# Altium project Flight_controller.PrjPcb
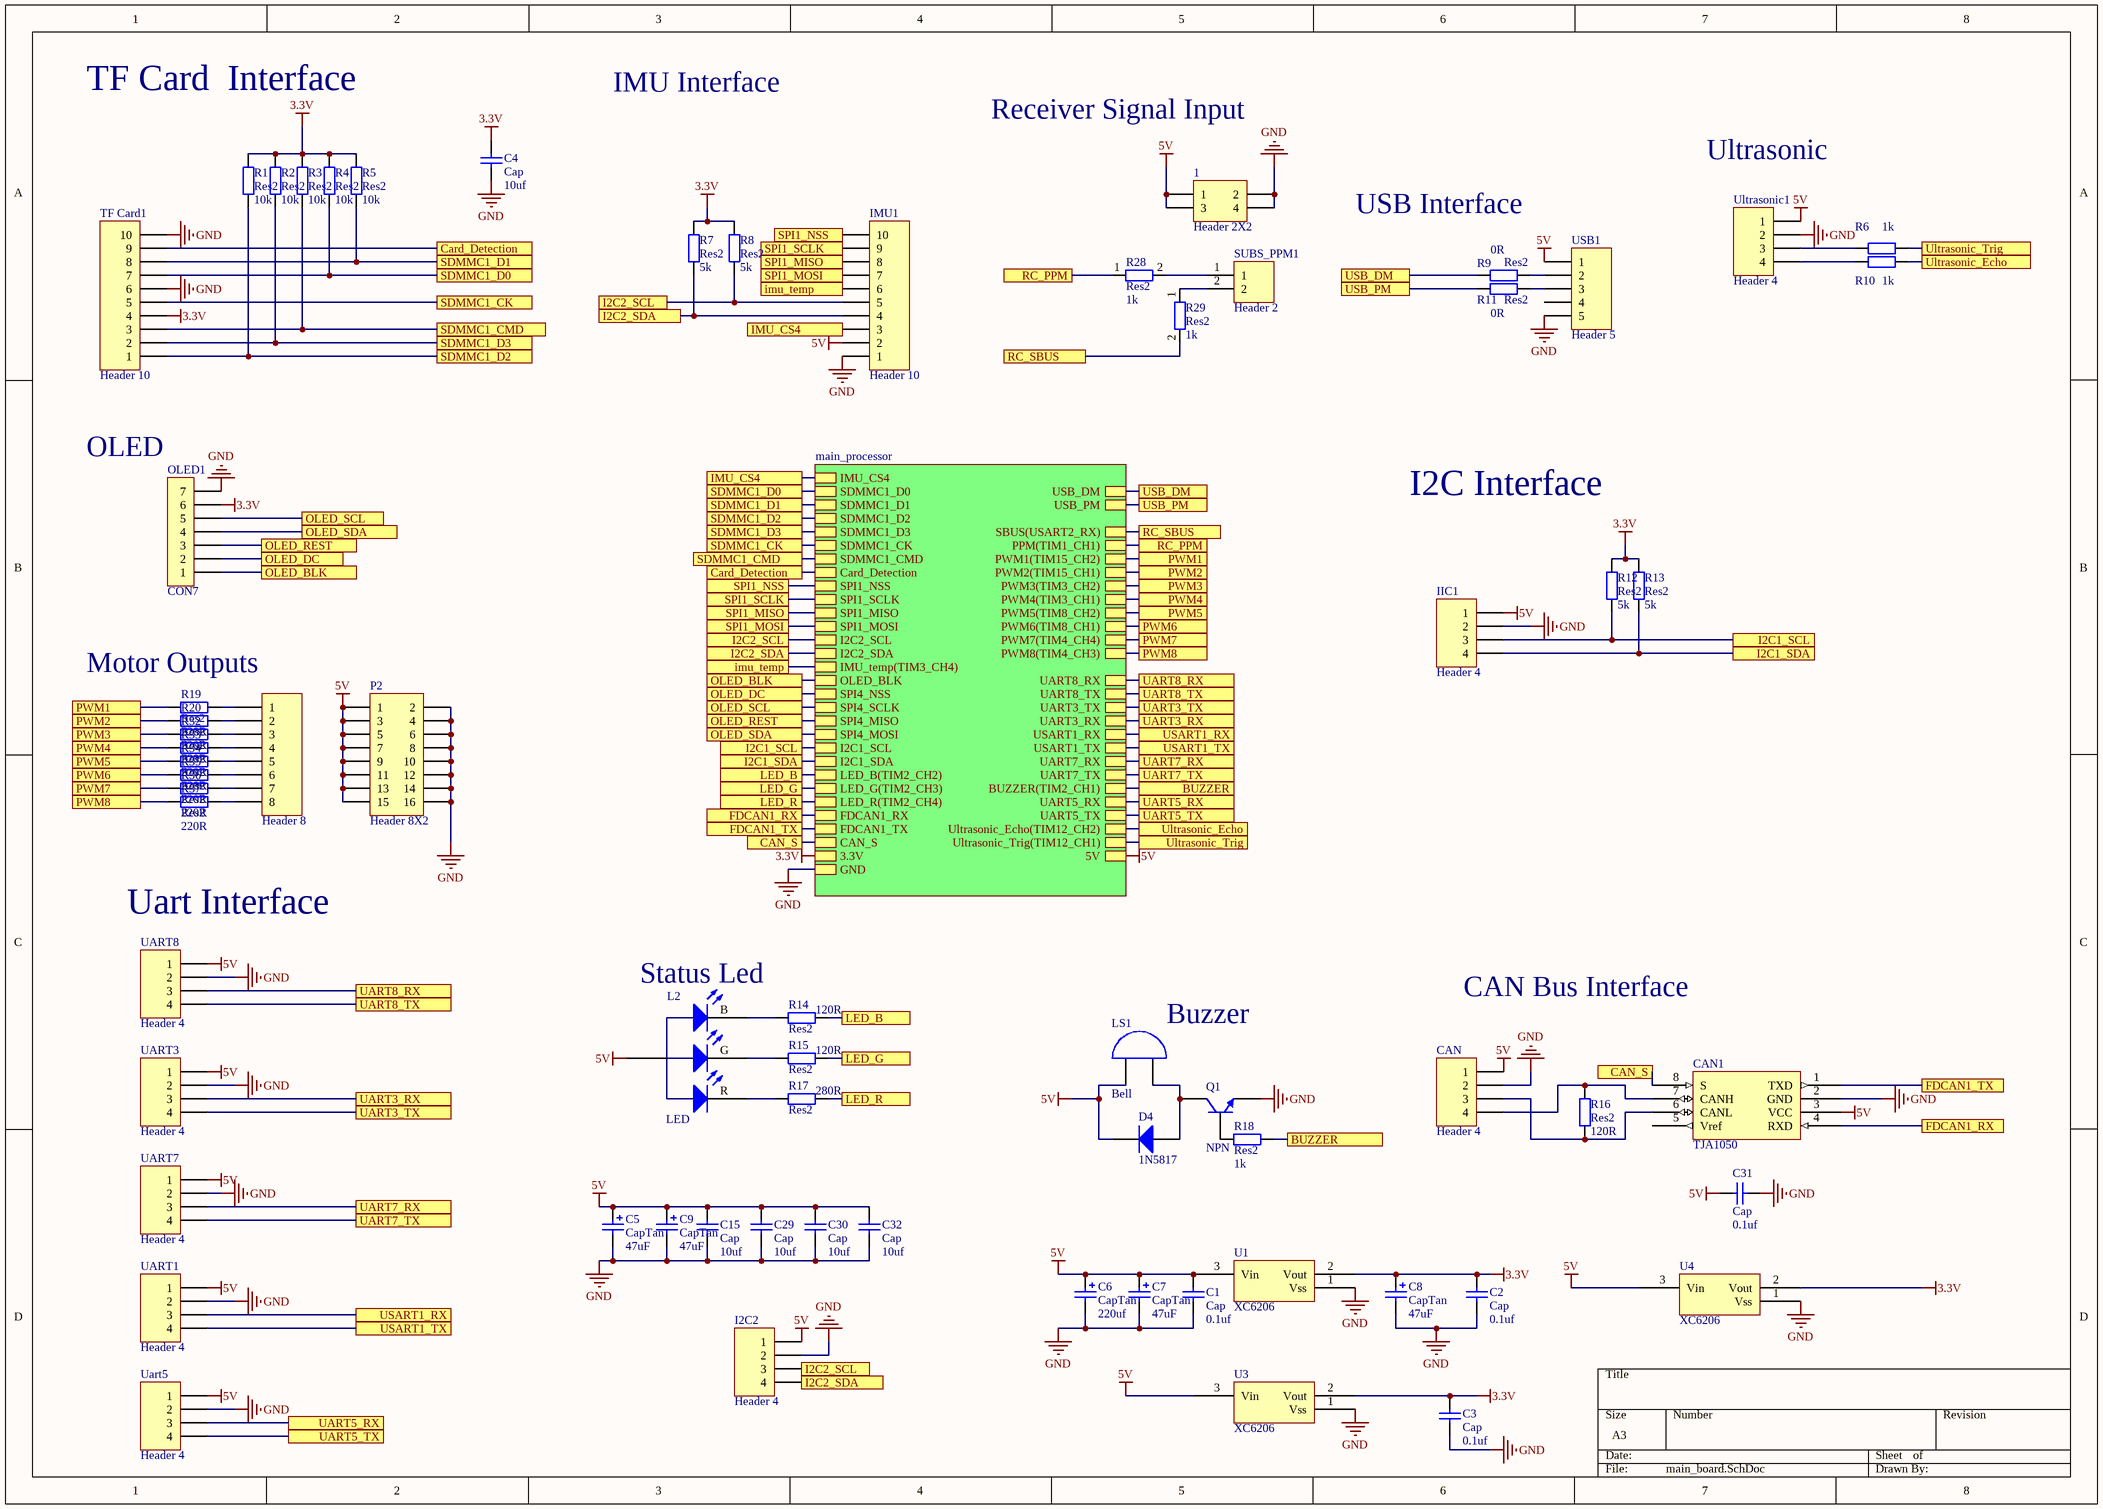
[diagram p0: main_board.SchDoc]
2 sheets, 107 parts. Net scope: strictly hierarchical (ports join the sheet entries above them; power ports are local).
Sheets:
  main_board.SchDoc
    main_processor = main_processor.SchDoc

## Sheet main_board.SchDoc
size A3

### Parts
1  Header 2X2  [HDR2X2]
?  Header 8  [HDR1X8]
C1  Cap  value 0.1uf  [0603]
C2  Cap  value 0.1uf  [0603]
C3  Cap  value 0.1uf  [0603]
C4  Cap  value 10uf  [0603]
C5  CapTan  value 47uF  [1206_P]
C6  CapTan  value 220uf  [3528_P]
C7  CapTan  value 47uF  [1206_P]
C8  CapTan  value 47uF  [1206_P]
C9  CapTan  value 47uF  [1206_P]
C15  Cap  value 10uf  [0603]
C29  Cap  value 10uf  [0603]
C30  Cap  value 10uf  [0603]
C31  Cap  value 0.1uf  [0603]
C32  Cap  value 10uf  [0603]
CAN  Header 4  [SH_1.25mm_LT_4P]
CAN1  TJA1050  [SO8_M]
D4  1N5817  [SOD323]
I2C2  Header 4  [SH_1.25mm_LT_4P]
IIC1  Header 4  [SH_1.25mm_LT_4P]
IMU1  Header 10  [FPC 0.5mm 10pin]
L2  LED  [LED_3528_RGB]
LS1  Bell  [Buzzer_1030]
OLED1  CON7  [HDR1X7]
P2  Header 8X2  [HDR2X8]
Q1  NPN  [SOT23_N]
R1  Res2  value 10k  [0603]
R2  Res2  value 10k  [0603]
R3  Res2  value 10k  [0603]
R4  Res2  value 10k  [0603]
R5  Res2  value 10k  [0603]
R6  value 1k  [0603]  (hidden comment: Res2)
R7  Res2  value 5k  [0603]
R8  Res2  value 5k  [0603]
R9  Res2  value 0R  [0603]
R10  value 1k  [0603]  (hidden comment: Res2)
R11  Res2  value 0R  [0603]
R12  Res2  value 5k  [0603]
R13  Res2  value 5k  [0603]
R14  Res2  value 120R  [0603]
R15  Res2  value 120R  [0603]
R16  Res2  value 120R  [0603]
R17  Res2  value 280R  [0603]
R18  Res2  value 1k  [0603]
R19  Res2  value 220R  [0603]
R20  Res2  value 220R  [0603]
R28  Res2  value 1k  [0603]
R29  Res2  value 1k  [0603]
R32  Res2  value 220R  [0603]
R33  Res2  value 220R  [0603]
R34  Res2  value 220R  [0603]
R35  Res2  value 220R  [0603]
R36  Res2  value 220R  [0603]
R37  Res2  value 220R  [0603]
SUBS_PPM1  Header 2  [HDR1X2]
TF_Card1  Header 10  [MicroSD]
U1  XC6206  [SOT23]
U3  XC6206  [SOT23]
U4  XC6206  [SOT23]
UART1  Header 4  [SH_1.25mm_LT_4P]
UART3  Header 4  [SH_1.25mm_LT_4P]
Uart5  Header 4  [SH_1.25mm_LT_4P]
UART7  Header 4  [SH_1.25mm_LT_4P]
UART8  Header 4  [SH_1.25mm_LT_4P]
Ultrasonic1  Header 4  [SH_1.25mm_LT_4P]
USB1  Header 5  [micro usb Type B SMC]

### Sub-sheets
main_processor = main_processor: SDMMC1_D0, SDMMC1_D1, SDMMC1_D2, SDMMC1_D3, SDMMC1_CK, SDMMC1_CMD, Card_Detection, SPI1_SCLK, SPI1_MISO, SPI1_MOSI, I2C2_SCL, I2C2_SDA, IMU_temp(TIM3_CH4), SPI1_NSS, SPI4_NSS, SPI4_SCLK, SPI4_MISO, SPI4_MOSI, USB_DM, USB_PM, PWM1(TIM15_CH2), PWM2(TIM15_CH1), PWM3(TIM3_CH2), PWM4(TIM3_CH1), PWM5(TIM8_CH2), PWM6(TIM8_CH1), PWM7(TIM4_CH4), PWM8(TIM4_CH3), UART8_RX, UART8_TX, UART3_TX, UART3_RX, USART1_RX, USART1_TX, UART7_RX, UART7_TX, I2C1_SCL, I2C1_SDA, LED_B(TIM2_CH2), LED_G(TIM2_CH3), LED_R(TIM2_CH4), BUZZER(TIM2_CH1), UART5_RX, UART5_TX, FDCAN1_RX, FDCAN1_TX, Ultrasonic_Echo(TIM12_CH2), Ultrasonic_Trig(TIM12_CH1), 3.3V, GND, 5V, SBUS(USART2_RX), PPM(TIM1_CH1), CAN_S, OLED_BLK, IMU_CS4

### Ports
BUZZER, CAN_S, Card_Detection, FDCAN1_RX, FDCAN1_TX, I2C1_SCL, I2C1_SDA, I2C2_SCL, I2C2_SDA, IMU_CS4, imu_temp, LED_B, LED_G, LED_R, OLED_BLK, OLED_DC, OLED_REST, OLED_SCL, OLED_SDA, PWM1, PWM2, PWM3, PWM4, PWM5, PWM6, PWM7, PWM8, RC_PPM, RC_SBUS, SDMMC1_CK, SDMMC1_CMD, SDMMC1_D0, SDMMC1_D1, SDMMC1_D2, SDMMC1_D3, SPI1_MISO, SPI1_MOSI, SPI1_NSS, SPI1_SCLK, UART3_RX, UART3_TX, UART5_RX, UART5_TX, UART7_RX, UART7_TX, UART8_RX, UART8_TX, Ultrasonic_Echo, Ultrasonic_Trig, USART1_RX, USART1_TX, USB_DM, USB_PM

### Nets
3.3V: C2.2 C3.2 C4.2 C8.1 OLED1.6 R1.2 R2.2 R3.1 R4.2 R5.2 R7.2 R8.2 R12.2 R13.2 TF_Card1.4 U1.2(Vout) U3.2(Vout) U4.2(Vout) ; sheet main_processor/3.3V
5V: 1.1 1.3 C1.2 C5.1 C6.1 C7.1 C9.1 C15.2 C29.2 C30.2 C31.2 C32.2 CAN.1 CAN1.3(VCC) D4.2(K) I2C2.1 IIC1.1 IMU1.2 L2.1 LS1.1(A) P2.1 P2.3 P2.5 P2.7 P2.9 P2.11 P2.13 P2.15 U1.3(Vin) U3.3(Vin) U4.3(Vin) UART1.1 UART3.1 Uart5.1 UART7.1 UART8.1 Ultrasonic1.1 USB1.1 ; sheet main_processor/5V
GND: 1.2 1.4 C1.1 C2.1 C3.1 C4.1 C5.2 C6.2 C7.2 C8.2 C9.2 C15.1 C29.1 C30.1 C31.1 C32.1 CAN.2 CAN1.2(GND) I2C2.2 IIC1.2 IMU1.1 OLED1.7 P2.2 P2.4 P2.6 P2.8 P2.10 P2.12 P2.14 P2.16 Q1.3(E) TF_Card1.6 TF_Card1.10 U1.1(Vss) U3.1(Vss) U4.1(Vss) UART1.2 UART3.2 Uart5.2 UART7.2 UART8.2 Ultrasonic1.2 USB1.5 ; sheet main_processor/GND
Net?_1: ?.1 R19.1
Net?_2: ?.2 R20.1
Net?_3: ?.3 R32.1
Net?_4: ?.4 R33.1
Net?_5: ?.5 R34.1
Net?_6: ?.6 R35.1
Net?_7: ?.7 R36.1
Net?_8: ?.8 R37.1
NetCAN1_1: CAN1.1(TXD) ; port FDCAN1_TX, sheet main_processor/FDCAN1_TX
NetCAN1_4: CAN1.4(RXD) ; port FDCAN1_RX, sheet main_processor/FDCAN1_RX
NetCAN1_8: CAN1.8(S) ; port CAN_S, sheet main_processor/CAN_S
NetCAN_3: CAN.3 CAN1.6(CANL) R16.1
NetCAN_4: CAN.4 CAN1.7(CANH) R16.2
NetD4_1: D4.1(A) LS1.2(B) Q1.1(C)
NetI2C2_3: I2C2.3 IMU1.5 R8.1 ; port I2C2_SCL, sheet main_processor/I2C2_SCL
NetI2C2_4: I2C2.4 IMU1.4 R7.1 ; port I2C2_SDA, sheet main_processor/I2C2_SDA
NetIIC1_3: IIC1.3 R12.1 ; port I2C1_SCL, sheet main_processor/I2C1_SCL
NetIIC1_4: IIC1.4 R13.1 ; port I2C1_SDA, sheet main_processor/I2C1_SDA
NetIMU1_3: IMU1.3 ; port IMU_CS4, sheet main_processor/IMU_CS4
NetIMU1_6: IMU1.6 ; port imu_temp, sheet main_processor/IMU_temp(TIM3_CH4)
NetIMU1_7: IMU1.7 ; port SPI1_MOSI, sheet main_processor/SPI1_MOSI
NetIMU1_8: IMU1.8 ; port SPI1_MISO, sheet main_processor/SPI1_MISO
NetIMU1_9: IMU1.9 ; port SPI1_SCLK, sheet main_processor/SPI1_SCLK
NetIMU1_10: IMU1.10 ; port SPI1_NSS, sheet main_processor/SPI1_NSS
NetL2_B: L2.B R14.2
NetL2_G: L2.G R15.2
NetL2_R: L2.R R17.2
NetOLED1_1: OLED1.1 ; port OLED_BLK, sheet main_processor/OLED_BLK
NetOLED1_2: OLED1.2 ; port OLED_DC, sheet main_processor/SPI4_NSS
NetOLED1_3: OLED1.3 ; port OLED_REST, sheet main_processor/SPI4_MISO
NetOLED1_4: OLED1.4 ; port OLED_SDA, sheet main_processor/SPI4_MOSI
NetOLED1_5: OLED1.5 ; port OLED_SCL, sheet main_processor/SPI4_SCLK
NetQ1_2: Q1.2(B) R18.2
NetR1_1: R1.1 TF_Card1.1 ; port SDMMC1_D2, sheet main_processor/SDMMC1_D2
NetR2_1: R2.1 TF_Card1.2 ; port SDMMC1_D3, sheet main_processor/SDMMC1_D3
NetR3_2: R3.2 TF_Card1.3 ; port SDMMC1_CMD, sheet main_processor/SDMMC1_CMD
NetR4_1: R4.1 TF_Card1.7 ; port SDMMC1_D0, sheet main_processor/SDMMC1_D0
NetR5_1: R5.1 TF_Card1.8 ; port SDMMC1_D1, sheet main_processor/SDMMC1_D1
NetR6_1: R6.1 ; port Ultrasonic_Trig, sheet main_processor/Ultrasonic_Trig(TIM12_CH1)
NetR6_2: R6.2 Ultrasonic1.3
NetR9_1: R9.1 USB1.2
NetR9_2: R9.2 ; port USB_DM, sheet main_processor/USB_DM
NetR10_1: R10.1 ; port Ultrasonic_Echo, sheet main_processor/Ultrasonic_Echo(TIM12_CH2)
NetR10_2: R10.2 Ultrasonic1.4
NetR11_1: R11.1 USB1.3
NetR11_2: R11.2 ; port USB_PM, sheet main_processor/USB_PM
NetR14_1: R14.1 ; port LED_B, sheet main_processor/LED_B(TIM2_CH2)
NetR15_1: R15.1 ; port LED_G, sheet main_processor/LED_G(TIM2_CH3)
NetR17_1: R17.1 ; port LED_R, sheet main_processor/LED_R(TIM2_CH4)
NetR18_1: R18.1 ; port BUZZER, sheet main_processor/BUZZER(TIM2_CH1)
NetR19_2: R19.2 ; port PWM1, sheet main_processor/PWM1(TIM15_CH2)
NetR20_2: R20.2 ; port PWM2, sheet main_processor/PWM2(TIM15_CH1)
NetR28_1: R28.1 ; port RC_PPM, sheet main_processor/PPM(TIM1_CH1)
NetR28_2: R28.2 SUBS_PPM1.1
NetR29_1: R29.1 SUBS_PPM1.2
NetR29_2: R29.2 ; port RC_SBUS, sheet main_processor/SBUS(USART2_RX)
NetR32_2: R32.2 ; port PWM3, sheet main_processor/PWM3(TIM3_CH2)
NetR33_2: R33.2 ; port PWM4, sheet main_processor/PWM4(TIM3_CH1)
NetR34_2: R34.2 ; port PWM5, sheet main_processor/PWM5(TIM8_CH2)
NetR35_2: R35.2 ; port PWM6, sheet main_processor/PWM6(TIM8_CH1)
NetR36_2: R36.2 ; port PWM7, sheet main_processor/PWM7(TIM4_CH4)
NetR37_2: R37.2 ; port PWM8, sheet main_processor/PWM8(TIM4_CH3)
Netstm32h743VIT6_37: UART7.3 ; port UART7_RX, sheet main_processor/UART7_RX
Netstm32h743VIT6_38: UART7.4 ; port UART7_TX, sheet main_processor/UART7_TX
Netstm32h743VIT6_51: Uart5.3 ; port UART5_RX, sheet main_processor/UART5_RX
Netstm32h743VIT6_52: Uart5.4 ; port UART5_TX, sheet main_processor/UART5_TX
Netstm32h743VIT6_55: UART3.4 ; port UART3_TX, sheet main_processor/UART3_TX
Netstm32h743VIT6_56: UART3.3 ; port UART3_RX, sheet main_processor/UART3_RX
Netstm32h743VIT6_68: UART1.4 ; port USART1_TX, sheet main_processor/USART1_TX
Netstm32h743VIT6_69: UART1.3 ; port USART1_RX, sheet main_processor/USART1_RX
Netstm32h743VIT6_77: TF_Card1.9 ; port Card_Detection, sheet main_processor/Card_Detection
Netstm32h743VIT6_80: TF_Card1.5 ; port SDMMC1_CK, sheet main_processor/SDMMC1_CK
Netstm32h743VIT6_97: UART8.3 ; port UART8_RX, sheet main_processor/UART8_RX
Netstm32h743VIT6_98: UART8.4 ; port UART8_TX, sheet main_processor/UART8_TX

Not connected (* = marked no-connect by the designer): CAN1 5(Vref); USB1 4

### Notes on the sheet
- TF Card  Interface
- IMU Interface
- Receiver Signal Input
- Ultrasonic
- USB Interface
- OLED
- I2C Interface
- Motor Outputs
- (near UART8) Uart Interface
- Status Led
- (near LS1) Buzzer
- CAN Bus Interface

### Library data of the parts
1 = Header 2X2: Header, 2-Pin, Dual row; LatestRevisionDate: 17-Jul-2002; LatestRevisionNote: Re-released for DXP Platform.; Publisher: Altium Limited
? = Header 8: Header, 8-Pin; LatestRevisionDate: 17-Jul-2002; LatestRevisionNote: Re-released for DXP Platform.; Publisher: Altium Limited
C1-C4 C15 C29-C32 = Cap: Capacitor; Published: 8-Jun-2000; LatestRevisionDate: 17-Jul-2002; LatestRevisionNote: Re-released for DXP Platform.; PackageReference: RAD-0.3; Publisher: Altium Limited; PackageDescription: Radial Cap, Thru-Hole; 2 Leads; 0.3 in Pin Spacing
C5-C9 = Cap Pol2: Polarized Capacitor (Axial); Published: 8-Jun-2000; LatestRevisionDate: 17-Jul-2002; LatestRevisionNote: Re-released for DXP Platform.; PackageReference: POLAR0.8; Publisher: Altium Limited; PackageDescription: Polarized Capacitor; 2 Leads
CAN I2C2 IIC1 UART1 UART3 Uart5 UART7 UART8 Ultrasonic1 = Header 4: Header, 4-Pin; LatestRevisionDate: 17-Jul-2002; LatestRevisionNote: Re-released for DXP Platform.; Publisher: Altium Limited
CAN1 = TJA1050: High speed CAN transceiver
D4 = Diode: Default Diode; Published: 8-Jun-2000; LatestRevisionDate: 17-Jul-2002; LatestRevisionNote: Re-released for DXP Platform.; PackageVersion: Sep-1996; PackageReference: SMC; Publisher: Altium Limited; PackageDescription: DO-214-AB/SMC; 2 C-Bend Leads; Body 7.9 x 5.9 mm, inc. leads (LxW); Code_JEDEC: DO-214-AB
IMU1 TF_Card1 = Header 10: Header, 10-Pin; LatestRevisionDate: 17-Jul-2002; LatestRevisionNote: Re-released for DXP Platform.; Publisher: Altium Limited
L2 = LED_RGB_CommonAnode: pin to pad: B>2 G>3 R>4
LS1 = Bell: Electrical Bell; Published: 24-Mar-1999; LatestRevisionDate: 17-Jul-2002; LatestRevisionNote: Re-released for DXP Platform.; PackageReference: PIN2; Publisher: Altium Limited
OLED1 = CON7: Connector
P2 = Header 8X2: Header, 8-Pin, Dual row; LatestRevisionDate: 17-Jul-2002; LatestRevisionNote: Re-released for DXP Platform.; Publisher: Altium Limited
Q1 = NPN: NPN Bipolar Transistor; pin to pad: 2>3 3>2; Published: 8-Jun-2000; LatestRevisionDate: 17-Jul-2002; LatestRevisionNote: Re-released for DXP Platform.; PackageReference: TO-226-AA; Publisher: Altium Limited; PackageDescription: TO, Flat Index; 3 In-Line, Axial Leads; Body Dia. 4.8mm; Leads 0.55 x 0.51 mm (max); Code_JEDEC: TO-226-AA
R1-R20 R28 R29 R32-R37 = Res2: Resistor; Published: 8-Jun-2000; LatestRevisionDate: 17-Jul-2002; LatestRevisionNote: Re-released for DXP Platform.; PackageReference: AXIAL-0.4; Publisher: Altium Limited; PackageDescription: Axial Device, Thru-Hole; 2 Leads; 0.4 in Pin Spacing
SUBS_PPM1 = Header 2: Header, 2-Pin; LatestRevisionDate: 17-Jul-2002; LatestRevisionNote: Re-released for DXP Platform.; Publisher: Altium Limited
USB1 = Header 5: Header, 5-Pin; LatestRevisionDate: 17-Jul-2002; LatestRevisionNote: Re-released for DXP Platform.; Publisher: Altium Limited

## Sheet main_processor.SchDoc
size A4
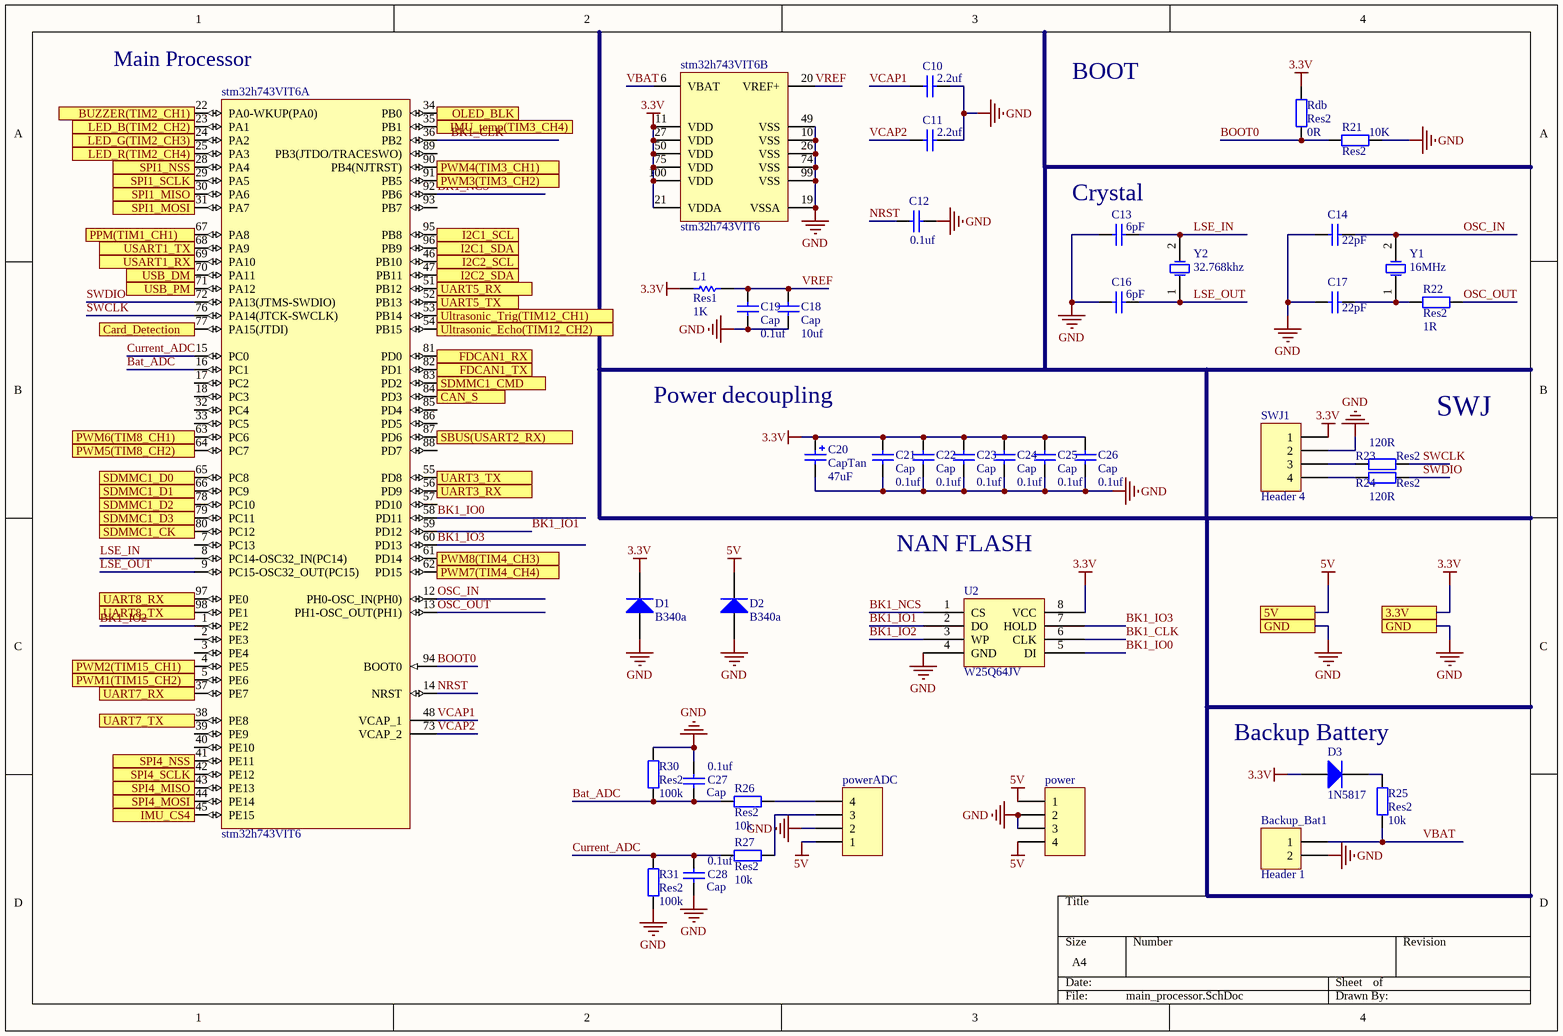
[diagram p1: main_processor.SchDoc]

### Parts
Backup_Bat1  Header 1  [Battery-MS621]
C10  value 2.2uf  [0603]  (hidden comment: Cap)
C11  value 2.2uf  [0603]  (hidden comment: Cap)
C12  value 0.1uf  [0603]  (hidden comment: Cap)
C13  value 6pF  [0603]  (hidden comment: Cap)
C14  value 22pF  [0603]  (hidden comment: Cap)
C16  value 6pF  [0603]  (hidden comment: Cap)
C17  value 22pF  [0603]  (hidden comment: Cap)
C18  Cap  value 10uf  [0603]
C19  Cap  value 0.1uf  [0603]
C20  CapTan  value 47uF  [1206_P]
C21  Cap  value 0.1uf  [0603]
C22  Cap  value 0.1uf  [0603]
C23  Cap  value 0.1uf  [0603]
C24  Cap  value 0.1uf  [0603]
C25  Cap  value 0.1uf  [0603]
C26  Cap  value 0.1uf  [0603]
C27  Cap  value 0.1uf  [0603]
C28  Cap  value 0.1uf  [0603]
D1  B340a  [DO_214_AC]
D2  B340a  [DO_214_AC]
D3  1N5817  [SOD323]
L1  Res1  value 1K  [AXIAL-0.3]
power  Header 2  [SH_1.25mm_LT_4P]  (value not drawn)
powerADC  Header 2  [SH_1.25mm_LT_4P]  (value not drawn)
R21  Res2  value 10K  [0603]
R22  Res2  value 1R  [0603]
R23  Res2  value 120R  [0603]
R24  Res2  value 120R  [0603]
R25  Res2  value 10k  [0603]
R26  Res2  value 10k  [0603]
R27  Res2  value 10k  [0603]
R30  Res2  value 100k  [0603]
R31  Res2  value 100k  [0603]
Rdb  Res2  value 0R  [0603]
stm32h743VIT6  stm32h743VIT6  [LQFP100-14x14mm]  (parts A,B of 2)
SWJ1  Header 4  [SH_1.25mm_LT_4P]
U2  W25Q64JV  [W25Q SOP8]
Y1  16MHz  [Crystal_SMD_3225]
Y2  32.768khz  [FC135]

### Ports
3.3V, 5V, BUZZER(TIM2_CH1), CAN_S, Card_Detection, FDCAN1_RX, FDCAN1_TX, GND, I2C1_SCL, I2C1_SDA, I2C2_SCL, I2C2_SDA, IMU_CS4, IMU_temp(TIM3_CH4), LED_B(TIM2_CH2), LED_G(TIM2_CH3), LED_R(TIM2_CH4), OLED_BLK, PPM(TIM1_CH1), PWM1(TIM15_CH2), PWM2(TIM15_CH1), PWM3(TIM3_CH2), PWM4(TIM3_CH1), PWM5(TIM8_CH2), PWM6(TIM8_CH1), PWM7(TIM4_CH4), PWM8(TIM4_CH3), SBUS(USART2_RX), SDMMC1_CK, SDMMC1_CMD, SDMMC1_D0, SDMMC1_D1, SDMMC1_D2, SDMMC1_D3, SPI1_MISO, SPI1_MOSI, SPI1_NSS, SPI1_SCLK, SPI4_MISO, SPI4_MOSI, SPI4_NSS, SPI4_SCLK, UART3_RX, UART3_TX, UART5_RX, UART5_TX, UART7_RX, UART7_TX, UART8_RX, UART8_TX, Ultrasonic_Echo(TIM12_CH2), Ultrasonic_Trig(TIM12_CH1), USART1_RX, USART1_TX, USB_DM, USB_PM

### Nets
3.3V: C20.1 C21.2 C22.2 C23.2 C24.2 C25.2 C26.2 D1.2(K) D3.1(A) L1.1 Rdb.2 stm32h743VIT6.11(VDD) stm32h743VIT6.21(VDDA) stm32h743VIT6.27(VDD) stm32h743VIT6.50(VDD) stm32h743VIT6.75(VDD) stm32h743VIT6.100(VDD) SWJ1.1 U2.8(VCC) ; port 3.3V
5V: D2.2(K) power.1 power.4 powerADC.1 ; port 5V
GND: Backup_Bat1.2 C10.2 C11.2 C12.1 C13.1 C14.1 C16.1 C17.1 C18.1 C19.1 C20.2 C21.1 C22.1 C23.1 C24.1 C25.1 C26.1 C27.2 C28.1 D1.1(A) D2.1(A) power.2 power.3 powerADC.2 R21.2 R30.1 R31.2 stm32h743VIT6.10(VSS) stm32h743VIT6.19(VSSA) stm32h743VIT6.26(VSS) stm32h743VIT6.49(VSS) stm32h743VIT6.74(VSS) stm32h743VIT6.99(VSS) SWJ1.2 U2.4(GND) ; port GND
Bat_ADC: C27.1 R26.2 R30.2 stm32h743VIT6.16(PC1)
BK1_CLK: stm32h743VIT6.36(PB2) U2.6(CLK)
BK1_IO0: stm32h743VIT6.58(PD11) U2.5(DI)
BK1_IO1: stm32h743VIT6.59(PD12) U2.2(DO)
BK1_IO2: stm32h743VIT6.1(PE2) U2.3(WP)
BK1_IO3: stm32h743VIT6.60(PD13) U2.7(HOLD)
BK1_NCS: stm32h743VIT6.92(PB6) U2.1(CS)
BOOT0: R21.1 Rdb.1 stm32h743VIT6.94(BOOT0)
Current_ADC: C28.2 R27.2 R31.1 stm32h743VIT6.15(PC0)
LSE_IN: C13.2 stm32h743VIT6.8(PC14-OSC32_IN(PC14)) Y2.2(OSC2)
LSE_OUT: C16.2 stm32h743VIT6.9(PC15-OSC32_OUT(PC15)) Y2.1(OSC1)
NRST: C12.2 stm32h743VIT6.14(NRST)
OSC_IN: C14.2 stm32h743VIT6.12(PH0-OSC_IN(PH0)) Y1.2(OSC2)
OSC_OUT: R22.1 stm32h743VIT6.13(PH1-OSC_OUT(PH1))
SWCLK: R23.1 stm32h743VIT6.76(PA14(JTCK-SWCLK))
SWDIO: R24.1 stm32h743VIT6.72(PA13(JTMS-SWDIO))
VBAT: Backup_Bat1.1 R25.2 stm32h743VIT6.6(VBAT)
VCAP1: C10.1 stm32h743VIT6.48(VCAP_1)
VCAP2: C11.1 stm32h743VIT6.73(VCAP_2)
VREF: C18.2 C19.2 L1.2 stm32h743VIT6.20(VREF+)
NetC17_2: C17.2 R22.2 Y1.1(OSC1)
NetCAN1_1: stm32h743VIT6.82(PD1) ; port FDCAN1_TX
NetCAN1_4: stm32h743VIT6.81(PD0) ; port FDCAN1_RX
NetCAN1_8: stm32h743VIT6.84(PD3) ; port CAN_S
NetD3_2: D3.2(K) R25.1
NetI2C2_3: stm32h743VIT6.46(PB10) ; port I2C2_SCL
NetI2C2_4: stm32h743VIT6.47(PB11) ; port I2C2_SDA
NetIIC1_3: stm32h743VIT6.95(PB8) ; port I2C1_SCL
NetIIC1_4: stm32h743VIT6.96(PB9) ; port I2C1_SDA
NetIMU1_3: stm32h743VIT6.45(PE15) ; port IMU_CS4
NetIMU1_6: stm32h743VIT6.35(PB1) ; port IMU_temp(TIM3_CH4)
NetIMU1_7: stm32h743VIT6.31(PA7) ; port SPI1_MOSI
NetIMU1_8: stm32h743VIT6.30(PA6) ; port SPI1_MISO
NetIMU1_9: stm32h743VIT6.29(PA5) ; port SPI1_SCLK
NetIMU1_10: stm32h743VIT6.28(PA4) ; port SPI1_NSS
NetOLED1_1: stm32h743VIT6.34(PB0) ; port OLED_BLK
NetOLED1_2: stm32h743VIT6.41(PE11) ; port SPI4_NSS
NetOLED1_3: stm32h743VIT6.43(PE13) ; port SPI4_MISO
NetOLED1_4: stm32h743VIT6.44(PE14) ; port SPI4_MOSI
NetOLED1_5: stm32h743VIT6.42(PE12) ; port SPI4_SCLK
NetpowerADC_3: powerADC.3 R27.1
NetpowerADC_4: powerADC.4 R26.1
NetR1_1: stm32h743VIT6.78(PC10) ; port SDMMC1_D2
NetR2_1: stm32h743VIT6.79(PC11) ; port SDMMC1_D3
NetR3_2: stm32h743VIT6.83(PD2) ; port SDMMC1_CMD
NetR4_1: stm32h743VIT6.65(PC8) ; port SDMMC1_D0
NetR5_1: stm32h743VIT6.66(PC9) ; port SDMMC1_D1
NetR6_1: stm32h743VIT6.53(PB14) ; port Ultrasonic_Trig(TIM12_CH1)
NetR9_2: stm32h743VIT6.70(PA11) ; port USB_DM
NetR10_1: stm32h743VIT6.54(PB15) ; port Ultrasonic_Echo(TIM12_CH2)
NetR11_2: stm32h743VIT6.71(PA12) ; port USB_PM
NetR14_1: stm32h743VIT6.23(PA1) ; port LED_B(TIM2_CH2)
NetR15_1: stm32h743VIT6.24(PA2) ; port LED_G(TIM2_CH3)
NetR17_1: stm32h743VIT6.25(PA3) ; port LED_R(TIM2_CH4)
NetR18_1: stm32h743VIT6.22(PA0-WKUP(PA0)) ; port BUZZER(TIM2_CH1)
NetR19_2: stm32h743VIT6.5(PE6) ; port PWM1(TIM15_CH2)
NetR20_2: stm32h743VIT6.4(PE5) ; port PWM2(TIM15_CH1)
NetR23_2: R23.2 SWJ1.3
NetR24_2: R24.2 SWJ1.4
NetR28_1: stm32h743VIT6.67(PA8) ; port PPM(TIM1_CH1)
NetR29_2: stm32h743VIT6.87(PD6) ; port SBUS(USART2_RX)
NetR32_2: stm32h743VIT6.91(PB5) ; port PWM3(TIM3_CH2)
NetR33_2: stm32h743VIT6.90(PB4(NJTRST)) ; port PWM4(TIM3_CH1)
NetR34_2: stm32h743VIT6.64(PC7) ; port PWM5(TIM8_CH2)
NetR35_2: stm32h743VIT6.63(PC6) ; port PWM6(TIM8_CH1)
NetR36_2: stm32h743VIT6.62(PD15) ; port PWM7(TIM4_CH4)
NetR37_2: stm32h743VIT6.61(PD14) ; port PWM8(TIM4_CH3)
Netstm32h743VIT6_37: stm32h743VIT6.37(PE7) ; port UART7_RX
Netstm32h743VIT6_38: stm32h743VIT6.38(PE8) ; port UART7_TX
Netstm32h743VIT6_51: stm32h743VIT6.51(PB12) ; port UART5_RX
Netstm32h743VIT6_52: stm32h743VIT6.52(PB13) ; port UART5_TX
Netstm32h743VIT6_55: stm32h743VIT6.55(PD8) ; port UART3_TX
Netstm32h743VIT6_56: stm32h743VIT6.56(PD9) ; port UART3_RX
Netstm32h743VIT6_68: stm32h743VIT6.68(PA9) ; port USART1_TX
Netstm32h743VIT6_69: stm32h743VIT6.69(PA10) ; port USART1_RX
Netstm32h743VIT6_77: stm32h743VIT6.77(PA15(JTDI)) ; port Card_Detection
Netstm32h743VIT6_80: stm32h743VIT6.80(PC12) ; port SDMMC1_CK
Netstm32h743VIT6_97: stm32h743VIT6.97(PE0) ; port UART8_RX
Netstm32h743VIT6_98: stm32h743VIT6.98(PE1) ; port UART8_TX

Not connected (* = marked no-connect by the designer): stm32h743VIT6 2(PE3) 3(PE4) 7(PC13) 17(PC2) 18(PC3) 32(PC4) 33(PC5) 39(PE9) 40(PE10) 57(PD10) 85(PD4) 86(PD5) 88(PD7) 89(PB3(JTDO/TRACESWO)) 93(PB7)

### Notes on the sheet
- (near stm32h743VIT6) Main Processor
- BOOT
- (near C13) Crystal
- Power decoupling
- SWJ
- NAN FLASH
- Backup Battery

### Library data of the parts
Backup_Bat1 = Header 2: Header, 2-Pin; LatestRevisionDate: 17-Jul-2002; LatestRevisionNote: Re-released for DXP Platform.; Publisher: Altium Limited
C10-C14 C16-C19 C21-C28 = Cap: Capacitor; Published: 8-Jun-2000; LatestRevisionDate: 17-Jul-2002; LatestRevisionNote: Re-released for DXP Platform.; PackageReference: RAD-0.3; Publisher: Altium Limited; PackageDescription: Radial Cap, Thru-Hole; 2 Leads; 0.3 in Pin Spacing
C20 = Cap Pol2: Polarized Capacitor (Axial); Published: 8-Jun-2000; LatestRevisionDate: 17-Jul-2002; LatestRevisionNote: Re-released for DXP Platform.; PackageReference: POLAR0.8; Publisher: Altium Limited; PackageDescription: Polarized Capacitor; 2 Leads
D1-D3 = Diode: Default Diode; Published: 8-Jun-2000; LatestRevisionDate: 17-Jul-2002; LatestRevisionNote: Re-released for DXP Platform.; PackageVersion: Sep-1996; PackageReference: SMC; Publisher: Altium Limited; PackageDescription: DO-214-AB/SMC; 2 C-Bend Leads; Body 7.9 x 5.9 mm, inc. leads (LxW); Code_JEDEC: DO-214-AB
L1 = Res1: Resistor; Published: 8-Jun-2000; LatestRevisionDate: 17-Jul-2002; LatestRevisionNote: Re-released for DXP Platform.; PackageReference: AXIAL-0.3; Publisher: Altium Limited; PackageDescription: Axial Device, Thru-Hole; 2 Leads; 0.3 in Pin Spacing
power powerADC SWJ1 = Header 4: Header, 4-Pin; LatestRevisionDate: 17-Jul-2002; LatestRevisionNote: Re-released for DXP Platform.; Publisher: Altium Limited
R21-R27 R30 R31 Rdb = Res2: Resistor; Published: 8-Jun-2000; LatestRevisionDate: 17-Jul-2002; LatestRevisionNote: Re-released for DXP Platform.; PackageReference: AXIAL-0.4; Publisher: Altium Limited; PackageDescription: Axial Device, Thru-Hole; 2 Leads; 0.4 in Pin Spacing
Y1 Y2 = XTAL: Crystal Oscillator; Published: 8-Jun-2000; LatestRevisionDate: 17-Jul-2002; LatestRevisionNote: Re-released for DXP Platform.; Publisher: Altium Limited

## Nets that join several sheets
3.3V: main_board (18 pins), main_processor (19 pins)
5V: main_board (38 pins), main_processor (D2.2 power.1 power.4 powerADC.1)
GND: main_board (43 pins), main_processor (35 pins)
NetCAN1_1: main_board (CAN1.1), main_processor (stm32h743VIT6.82)
NetCAN1_4: main_board (CAN1.4), main_processor (stm32h743VIT6.81)
NetCAN1_8: main_board (CAN1.8), main_processor (stm32h743VIT6.84)
NetI2C2_3: main_board (I2C2.3 IMU1.5 R8.1), main_processor (stm32h743VIT6.46)
NetI2C2_4: main_board (I2C2.4 IMU1.4 R7.1), main_processor (stm32h743VIT6.47)
NetIIC1_3: main_board (IIC1.3 R12.1), main_processor (stm32h743VIT6.95)
NetIIC1_4: main_board (IIC1.4 R13.1), main_processor (stm32h743VIT6.96)
NetIMU1_3: main_board (IMU1.3), main_processor (stm32h743VIT6.45)
NetIMU1_6: main_board (IMU1.6), main_processor (stm32h743VIT6.35)
NetIMU1_7: main_board (IMU1.7), main_processor (stm32h743VIT6.31)
NetIMU1_8: main_board (IMU1.8), main_processor (stm32h743VIT6.30)
NetIMU1_9: main_board (IMU1.9), main_processor (stm32h743VIT6.29)
NetIMU1_10: main_board (IMU1.10), main_processor (stm32h743VIT6.28)
NetOLED1_1: main_board (OLED1.1), main_processor (stm32h743VIT6.34)
NetOLED1_2: main_board (OLED1.2), main_processor (stm32h743VIT6.41)
NetOLED1_3: main_board (OLED1.3), main_processor (stm32h743VIT6.43)
NetOLED1_4: main_board (OLED1.4), main_processor (stm32h743VIT6.44)
NetOLED1_5: main_board (OLED1.5), main_processor (stm32h743VIT6.42)
NetR1_1: main_board (R1.1 TF_Card1.1), main_processor (stm32h743VIT6.78)
NetR2_1: main_board (R2.1 TF_Card1.2), main_processor (stm32h743VIT6.79)
NetR3_2: main_board (R3.2 TF_Card1.3), main_processor (stm32h743VIT6.83)
NetR4_1: main_board (R4.1 TF_Card1.7), main_processor (stm32h743VIT6.65)
NetR5_1: main_board (R5.1 TF_Card1.8), main_processor (stm32h743VIT6.66)
NetR6_1: main_board (R6.1), main_processor (stm32h743VIT6.53)
NetR9_2: main_board (R9.2), main_processor (stm32h743VIT6.70)
NetR10_1: main_board (R10.1), main_processor (stm32h743VIT6.54)
NetR11_2: main_board (R11.2), main_processor (stm32h743VIT6.71)
NetR14_1: main_board (R14.1), main_processor (stm32h743VIT6.23)
NetR15_1: main_board (R15.1), main_processor (stm32h743VIT6.24)
NetR17_1: main_board (R17.1), main_processor (stm32h743VIT6.25)
NetR18_1: main_board (R18.1), main_processor (stm32h743VIT6.22)
NetR19_2: main_board (R19.2), main_processor (stm32h743VIT6.5)
NetR20_2: main_board (R20.2), main_processor (stm32h743VIT6.4)
NetR28_1: main_board (R28.1), main_processor (stm32h743VIT6.67)
NetR29_2: main_board (R29.2), main_processor (stm32h743VIT6.87)
NetR32_2: main_board (R32.2), main_processor (stm32h743VIT6.91)
NetR33_2: main_board (R33.2), main_processor (stm32h743VIT6.90)
NetR34_2: main_board (R34.2), main_processor (stm32h743VIT6.64)
NetR35_2: main_board (R35.2), main_processor (stm32h743VIT6.63)
NetR36_2: main_board (R36.2), main_processor (stm32h743VIT6.62)
NetR37_2: main_board (R37.2), main_processor (stm32h743VIT6.61)
Netstm32h743VIT6_37: main_board (UART7.3), main_processor (stm32h743VIT6.37)
Netstm32h743VIT6_38: main_board (UART7.4), main_processor (stm32h743VIT6.38)
Netstm32h743VIT6_51: main_board (Uart5.3), main_processor (stm32h743VIT6.51)
Netstm32h743VIT6_52: main_board (Uart5.4), main_processor (stm32h743VIT6.52)
Netstm32h743VIT6_55: main_board (UART3.4), main_processor (stm32h743VIT6.55)
Netstm32h743VIT6_56: main_board (UART3.3), main_processor (stm32h743VIT6.56)
Netstm32h743VIT6_68: main_board (UART1.4), main_processor (stm32h743VIT6.68)
Netstm32h743VIT6_69: main_board (UART1.3), main_processor (stm32h743VIT6.69)
Netstm32h743VIT6_77: main_board (TF_Card1.9), main_processor (stm32h743VIT6.77)
Netstm32h743VIT6_80: main_board (TF_Card1.5), main_processor (stm32h743VIT6.80)
Netstm32h743VIT6_97: main_board (UART8.3), main_processor (stm32h743VIT6.97)
Netstm32h743VIT6_98: main_board (UART8.4), main_processor (stm32h743VIT6.98)